# Altium schematic sheet WS2812_MATRIX_5.SchDoc
size A4
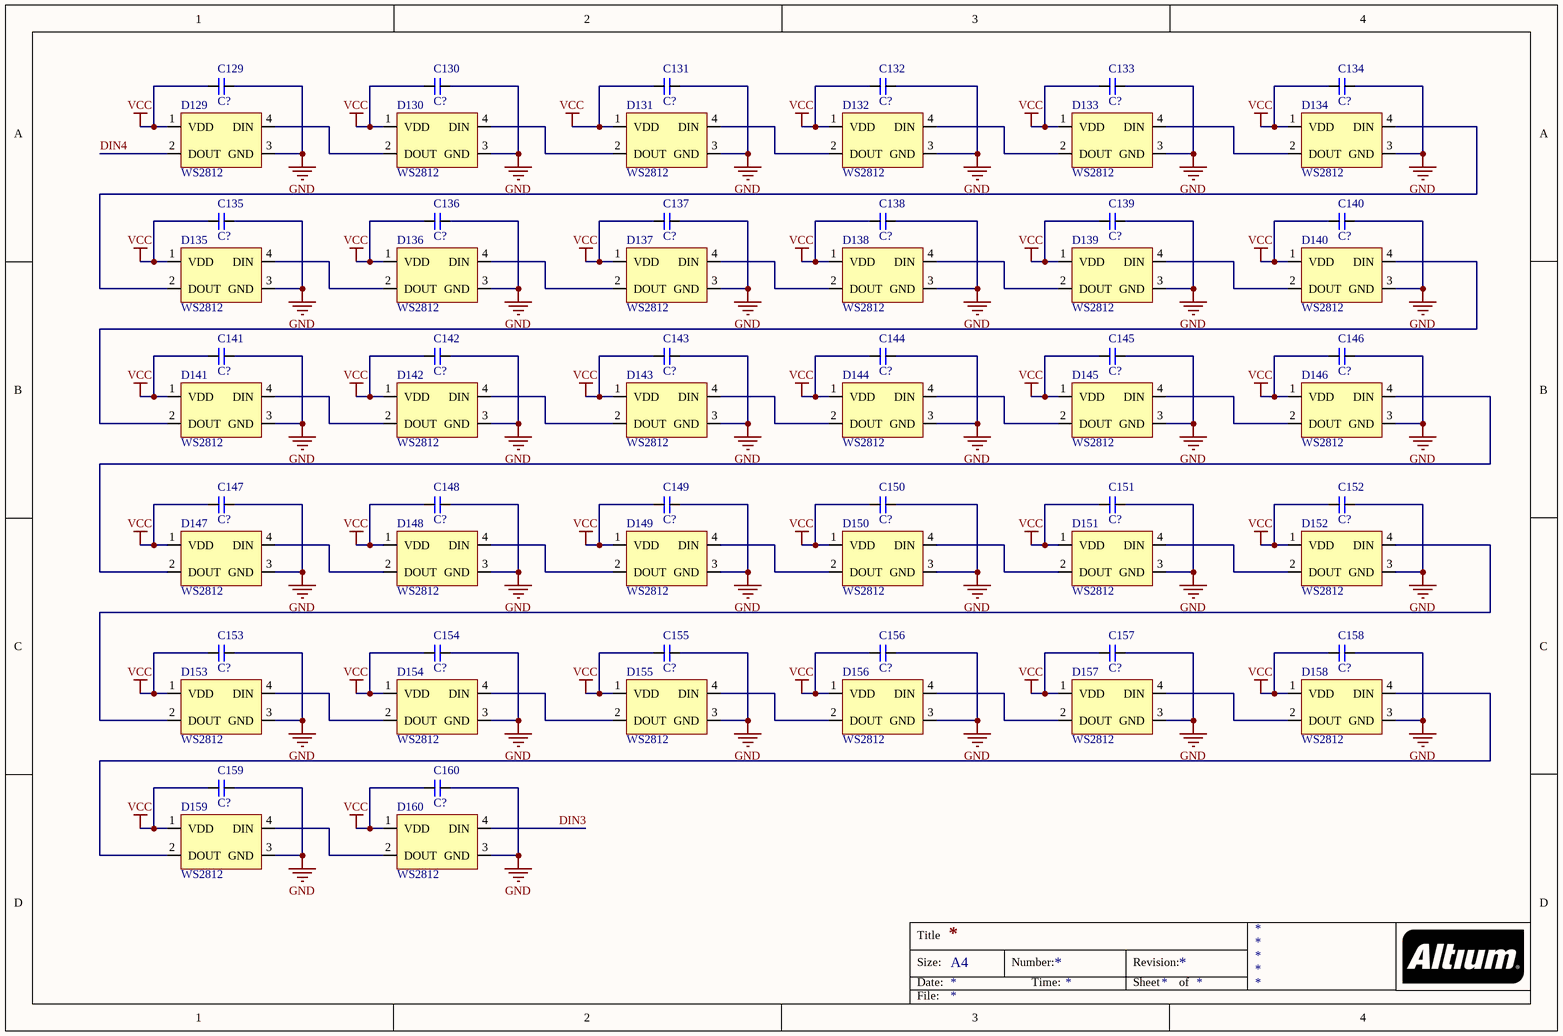
[diagram p0: WS2812_MATRIX_5.SchDoc]

## Parts
C129  C?  [C0603]
C130  C?  [C0603]
C131  C?  [C0603]
C132  C?  [C0603]
C133  C?  [C0603]
C134  C?  [C0603]
C135  C?  [C0603]
C136  C?  [C0603]
C137  C?  [C0603]
C138  C?  [C0603]
C139  C?  [C0603]
C140  C?  [C0603]
C141  C?  [C0603]
C142  C?  [C0603]
C143  C?  [C0603]
C144  C?  [C0603]
C145  C?  [C0603]
C146  C?  [C0603]
C147  C?  [C0603]
C148  C?  [C0603]
C149  C?  [C0603]
C150  C?  [C0603]
C151  C?  [C0603]
C152  C?  [C0603]
C153  C?  [C0603]
C154  C?  [C0603]
C155  C?  [C0603]
C156  C?  [C0603]
C157  C?  [C0603]
C158  C?  [C0603]
C159  C?  [C0603]
C160  C?  [C0603]
D129  WS2812  [WS2812_3528]
D130  WS2812  [WS2812_3528]
D131  WS2812  [WS2812_3528]
D132  WS2812  [WS2812_3528]
D133  WS2812  [WS2812_3528]
D134  WS2812  [WS2812_3528]
D135  WS2812  [WS2812_3528]
D136  WS2812  [WS2812_3528]
D137  WS2812  [WS2812_3528]
D138  WS2812  [WS2812_3528]
D139  WS2812  [WS2812_3528]
D140  WS2812  [WS2812_3528]
D141  WS2812  [WS2812_3528]
D142  WS2812  [WS2812_3528]
D143  WS2812  [WS2812_3528]
D144  WS2812  [WS2812_3528]
D145  WS2812  [WS2812_3528]
D146  WS2812  [WS2812_3528]
D147  WS2812  [WS2812_3528]
D148  WS2812  [WS2812_3528]
D149  WS2812  [WS2812_3528]
D150  WS2812  [WS2812_3528]
D151  WS2812  [WS2812_3528]
D152  WS2812  [WS2812_3528]
D153  WS2812  [WS2812_3528]
D154  WS2812  [WS2812_3528]
D155  WS2812  [WS2812_3528]
D156  WS2812  [WS2812_3528]
D157  WS2812  [WS2812_3528]
D158  WS2812  [WS2812_3528]
D159  WS2812  [WS2812_3528]
D160  WS2812  [WS2812_3528]

## Nets
GND: C129.2 C130.2 C131.2 C132.2 C133.2 C134.2 C135.2 C136.2 C137.2 C138.2 C139.2 C140.2 C141.2 C142.2 C143.2 C144.2 C145.2 C146.2 C147.2 C148.2 C149.2 C150.2 C151.2 C152.2 C153.2 C154.2 C155.2 C156.2 C157.2 C158.2 C159.2 C160.2 D129.3(GND) D130.3(GND) D131.3(GND) D132.3(GND) D133.3(GND) D134.3(GND) D135.3(GND) D136.3(GND) D137.3(GND) D138.3(GND) D139.3(GND) D140.3(GND) D141.3(GND) D142.3(GND) D143.3(GND) D144.3(GND) D145.3(GND) D146.3(GND) D147.3(GND) D148.3(GND) D149.3(GND) D150.3(GND) D151.3(GND) D152.3(GND) D153.3(GND) D154.3(GND) D155.3(GND) D156.3(GND) D157.3(GND) D158.3(GND) D159.3(GND) D160.3(GND)
VCC: C129.1 C130.1 C131.1 C132.1 C133.1 C134.1 C135.1 C136.1 C137.1 C138.1 C139.1 C140.1 C141.1 C142.1 C143.1 C144.1 C145.1 C146.1 C147.1 C148.1 C149.1 C150.1 C151.1 C152.1 C153.1 C154.1 C155.1 C156.1 C157.1 C158.1 C159.1 C160.1 D129.1(VDD) D130.1(VDD) D131.1(VDD) D132.1(VDD) D133.1(VDD) D134.1(VDD) D135.1(VDD) D136.1(VDD) D137.1(VDD) D138.1(VDD) D139.1(VDD) D140.1(VDD) D141.1(VDD) D142.1(VDD) D143.1(VDD) D144.1(VDD) D145.1(VDD) D146.1(VDD) D147.1(VDD) D148.1(VDD) D149.1(VDD) D150.1(VDD) D151.1(VDD) D152.1(VDD) D153.1(VDD) D154.1(VDD) D155.1(VDD) D156.1(VDD) D157.1(VDD) D158.1(VDD) D159.1(VDD) D160.1(VDD)
DIN3: D160.4(DIN)
DIN4: D129.2(DOUT)
NetD129_4: D129.4(DIN) D130.2(DOUT)
NetD130_4: D130.4(DIN) D131.2(DOUT)
NetD131_4: D131.4(DIN) D132.2(DOUT)
NetD132_4: D132.4(DIN) D133.2(DOUT)
NetD133_4: D133.4(DIN) D134.2(DOUT)
NetD134_4: D134.4(DIN) D135.2(DOUT)
NetD135_4: D135.4(DIN) D136.2(DOUT)
NetD136_4: D136.4(DIN) D137.2(DOUT)
NetD137_4: D137.4(DIN) D138.2(DOUT)
NetD138_4: D138.4(DIN) D139.2(DOUT)
NetD139_4: D139.4(DIN) D140.2(DOUT)
NetD140_4: D140.4(DIN) D141.2(DOUT)
NetD141_4: D141.4(DIN) D142.2(DOUT)
NetD142_4: D142.4(DIN) D143.2(DOUT)
NetD143_4: D143.4(DIN) D144.2(DOUT)
NetD144_4: D144.4(DIN) D145.2(DOUT)
NetD145_4: D145.4(DIN) D146.2(DOUT)
NetD146_4: D146.4(DIN) D147.2(DOUT)
NetD147_4: D147.4(DIN) D148.2(DOUT)
NetD148_4: D148.4(DIN) D149.2(DOUT)
NetD149_4: D149.4(DIN) D150.2(DOUT)
NetD150_4: D150.4(DIN) D151.2(DOUT)
NetD151_4: D151.4(DIN) D152.2(DOUT)
NetD152_4: D152.4(DIN) D153.2(DOUT)
NetD153_4: D153.4(DIN) D154.2(DOUT)
NetD154_4: D154.4(DIN) D155.2(DOUT)
NetD155_4: D155.4(DIN) D156.2(DOUT)
NetD156_4: D156.4(DIN) D157.2(DOUT)
NetD157_4: D157.4(DIN) D158.2(DOUT)
NetD158_4: D158.4(DIN) D159.2(DOUT)
NetD159_4: D159.4(DIN) D160.2(DOUT)

## Notes on the sheet
- Title
- Size:
- Date:
- A4
- Number:
- Time:
- Revision:
- Sheet
- of
- File:

## Library data of the parts
C129-C160 = CAP